# EAGLE schematic MonitorMain (EAGLE 8.6.0)
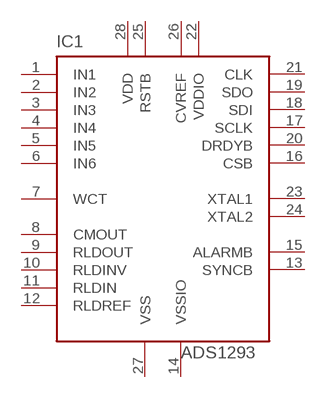
[diagram p0: schematic, sheet 1]

## Parts
IC1  ADS1293  [QFN28-5X5]
Unconnected: IC1.1(IN1) IC1.2(IN2) IC1.3(IN3) IC1.4(IN4) IC1.5(IN5) IC1.6(IN6) IC1.7(WCT) IC1.8(CMOUT) IC1.9(RLDOUT) IC1.10(RLDINV) IC1.11(RLDIN) IC1.12(RLDREF) IC1.13(SYNCB) IC1.15(ALARMB) IC1.16(CSB) IC1.17(SCLK) IC1.18(SDI) IC1.19(SDO) IC1.20(DRDYB) IC1.21(CLK) IC1.23(XTAL1) IC1.24(XTAL2) IC1.25(RSTB) IC1.26(CVREF)

## Power pins joined to a net without a drawn wire
VDD: IC1.28(VDD)
VDDIO: IC1.22(VDDIO)
VSS: IC1.27(VSS)
VSSIO: IC1.14(VSSIO)

## Library data of the parts
IC1 = texas-ads1293:ADS1293: The ADS1293 incorporates all features commonly required in portable, low-power medical, sports, and fitness electrocardiogram (ECG) applications. With high levels of integration and exceptional performance, the ADS1293 enables the creation of scalable medical instrumentation systems at significantly reduced size, power, and overall cost. The library has been designed by Richard Magdycz <https://www.facebook.com/groups/eaglecadsoftUK>